# EAGLE design circuit (EAGLE 9.6.0)
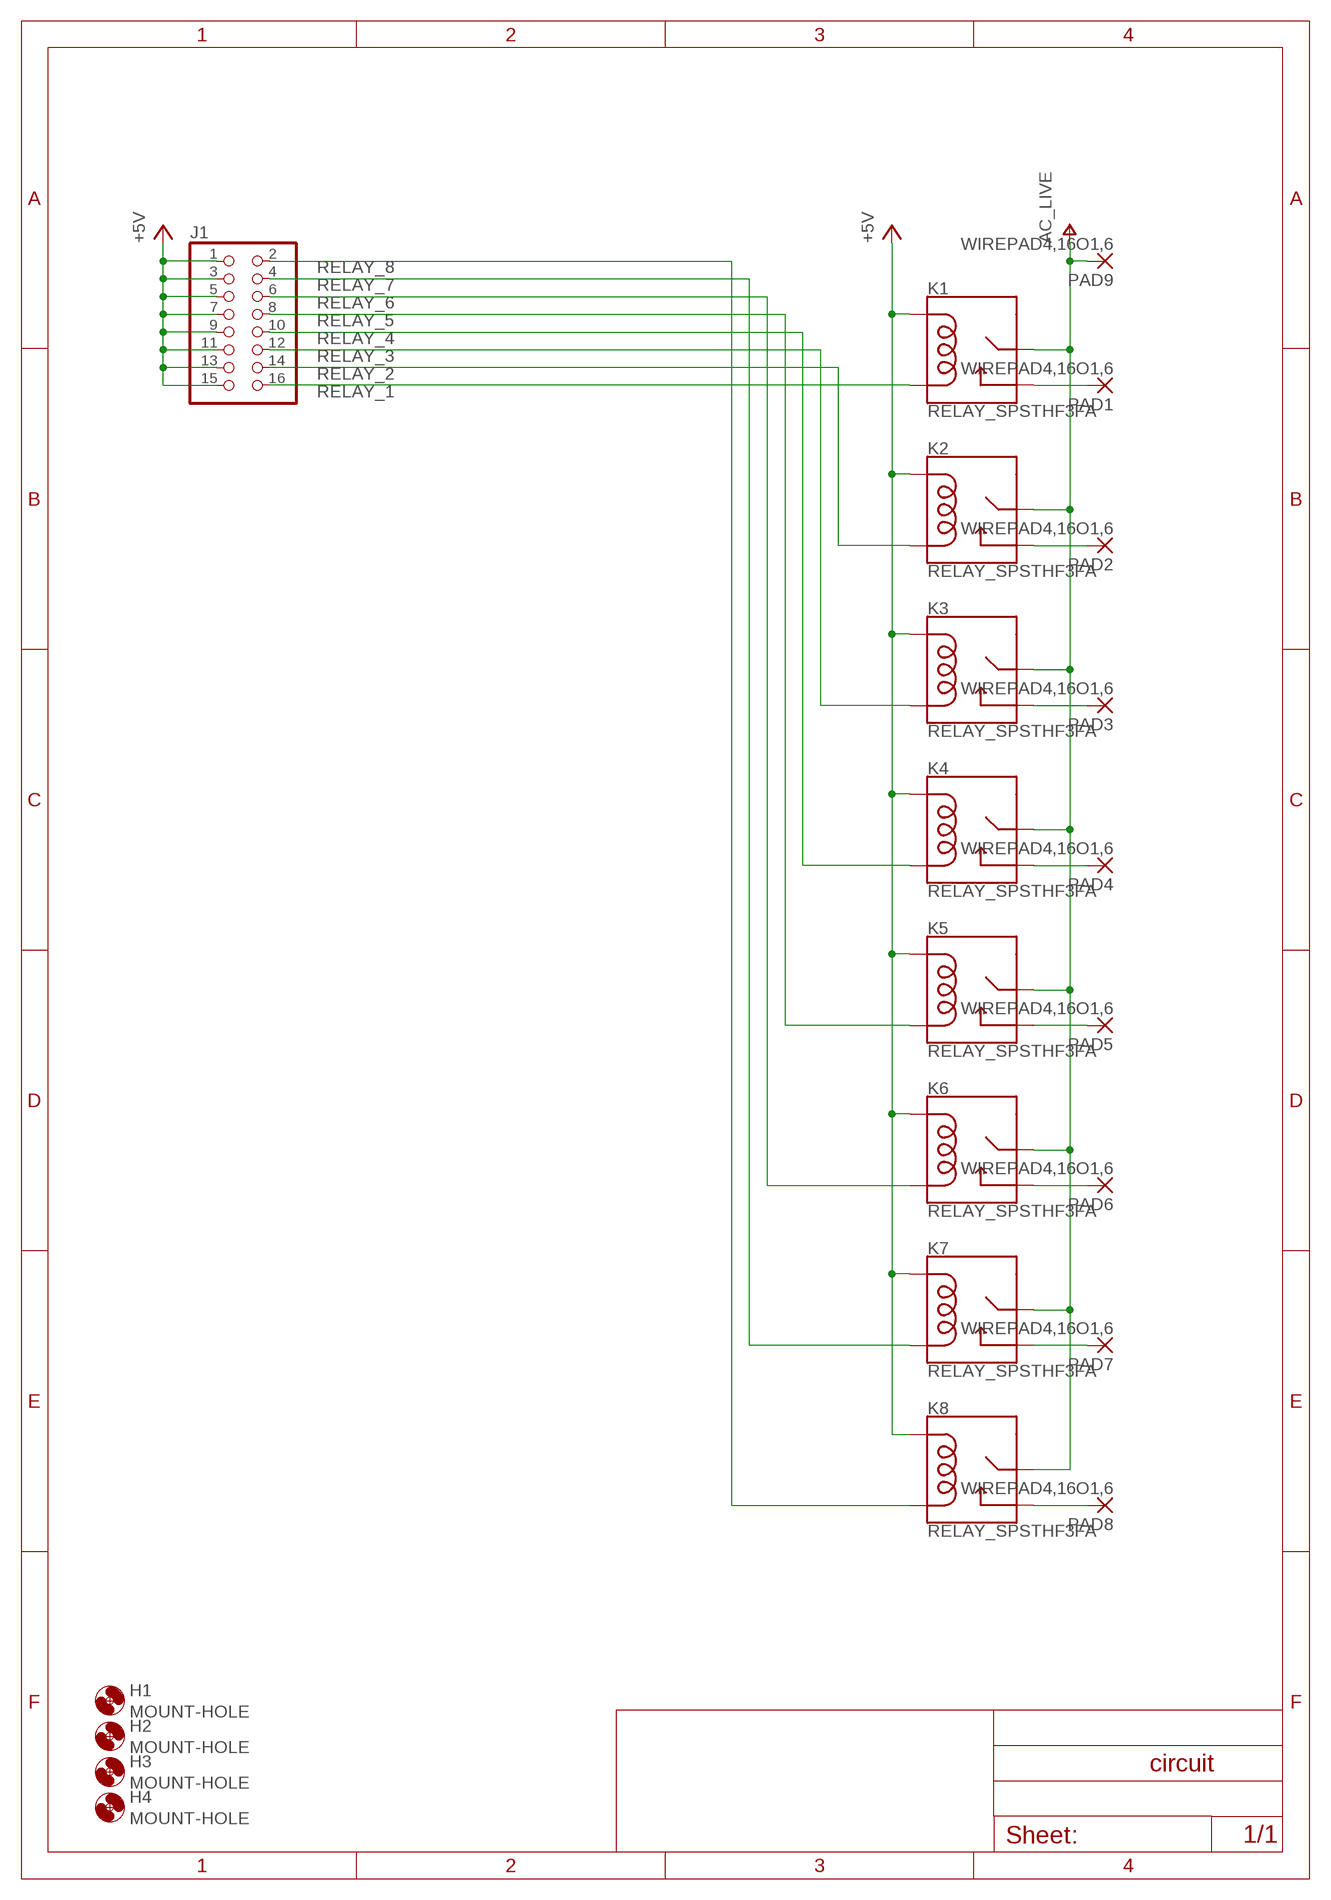
[diagram p0: schematic, sheet 1]

## Parts
H1  MOUNT-HOLE  [3,2]
H2  MOUNT-HOLE  [3,2]
H3  MOUNT-HOLE  [3,2]
H4  MOUNT-HOLE  [3,2]
J1  LED  PINHD-2X8  [2X08]
K1  RELAY_SPSTHF3FA  [RELAY_HF3FA]
K2  RELAY_SPSTHF3FA  [RELAY_HF3FA]
K3  RELAY_SPSTHF3FA  [RELAY_HF3FA]
K4  RELAY_SPSTHF3FA  [RELAY_HF3FA]
K5  RELAY_SPSTHF3FA  [RELAY_HF3FA]
K6  RELAY_SPSTHF3FA  [RELAY_HF3FA]
K7  RELAY_SPSTHF3FA  [RELAY_HF3FA]
K8  RELAY_SPSTHF3FA  [RELAY_HF3FA]
PAD1  WIREPAD4,16O1,6  [4,16O1,6]
PAD2  WIREPAD4,16O1,6  [4,16O1,6]
PAD3  WIREPAD4,16O1,6  [4,16O1,6]
PAD4  WIREPAD4,16O1,6  [4,16O1,6]
PAD5  WIREPAD4,16O1,6  [4,16O1,6]
PAD6  WIREPAD4,16O1,6  [4,16O1,6]
PAD7  WIREPAD4,16O1,6  [4,16O1,6]
PAD8  WIREPAD4,16O1,6  [4,16O1,6]
PAD9  WIREPAD4,16O1,6  [4,16O1,6]

## Nets
+5V: J1.1 J1.3 J1.5 J1.7 J1.9 J1.11 J1.13 J1.15 K1.P$1(COIL1) K2.P$1(COIL1) K3.P$1(COIL1) K4.P$1(COIL1) K5.P$1(COIL1) K6.P$1(COIL1) K7.P$1(COIL1) K8.P$1(COIL1)
N$17: K8.P$3(NO) PAD8.1(P)
N$18: K7.P$3(NO) PAD7.1(P)
N$19: K6.P$3(NO) PAD6.1(P)
N$20: K5.P$3(NO) PAD5.1(P)
N$21: K4.P$3(NO) PAD4.1(P)
N$22: K3.P$3(NO) PAD3.1(P)
N$23: K2.P$3(NO) PAD2.1(P)
N$24: K1.P$3(NO) PAD1.1(P)
RELAY_1: J1.16 K1.P$2(COIL2)
RELAY_2: J1.14 K2.P$2(COIL2)
RELAY_3: J1.12 K3.P$2(COIL2)
RELAY_4: J1.10 K4.P$2(COIL2)
RELAY_5: J1.8 K5.P$2(COIL2)
RELAY_6: J1.6 K6.P$2(COIL2)
RELAY_7: J1.4 K7.P$2(COIL2)
RELAY_8: J1.2 K8.P$2(COIL2)
V+: K1.P$4(MAIN) K2.P$4(MAIN) K3.P$4(MAIN) K4.P$4(MAIN) K5.P$4(MAIN) K6.P$4(MAIN) K7.P$4(MAIN) K8.P$4(MAIN) PAD9.1(P) ; supply symbol labelled AC_LIVE

## Library data of the parts
H1-H4 = THT:MOUNT-HOLE
J1 = THT:PINHD-2X8: PIN HEADER
K1-K8 = THT:RELAY_SPST
PAD1-PAD9 = THT:WIREPAD: Wire PAD connect wire on PCB

## Board
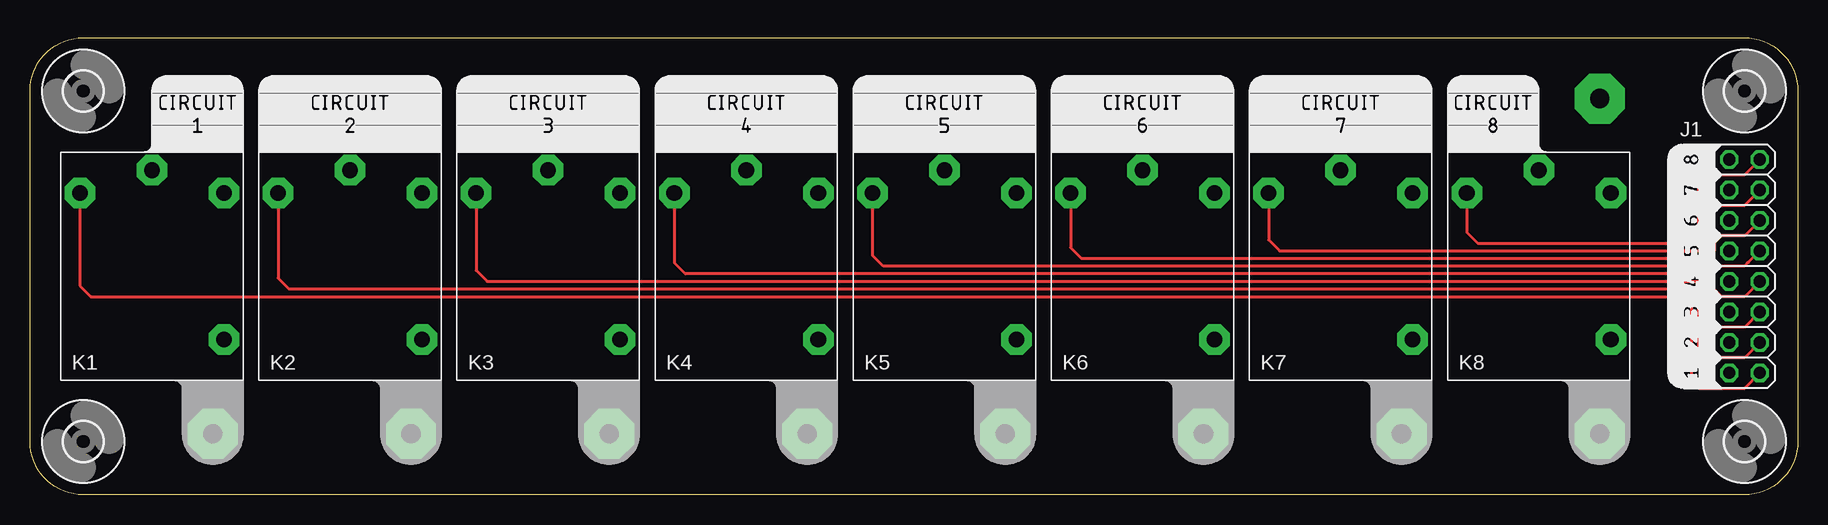
[diagram p1: board, top side]
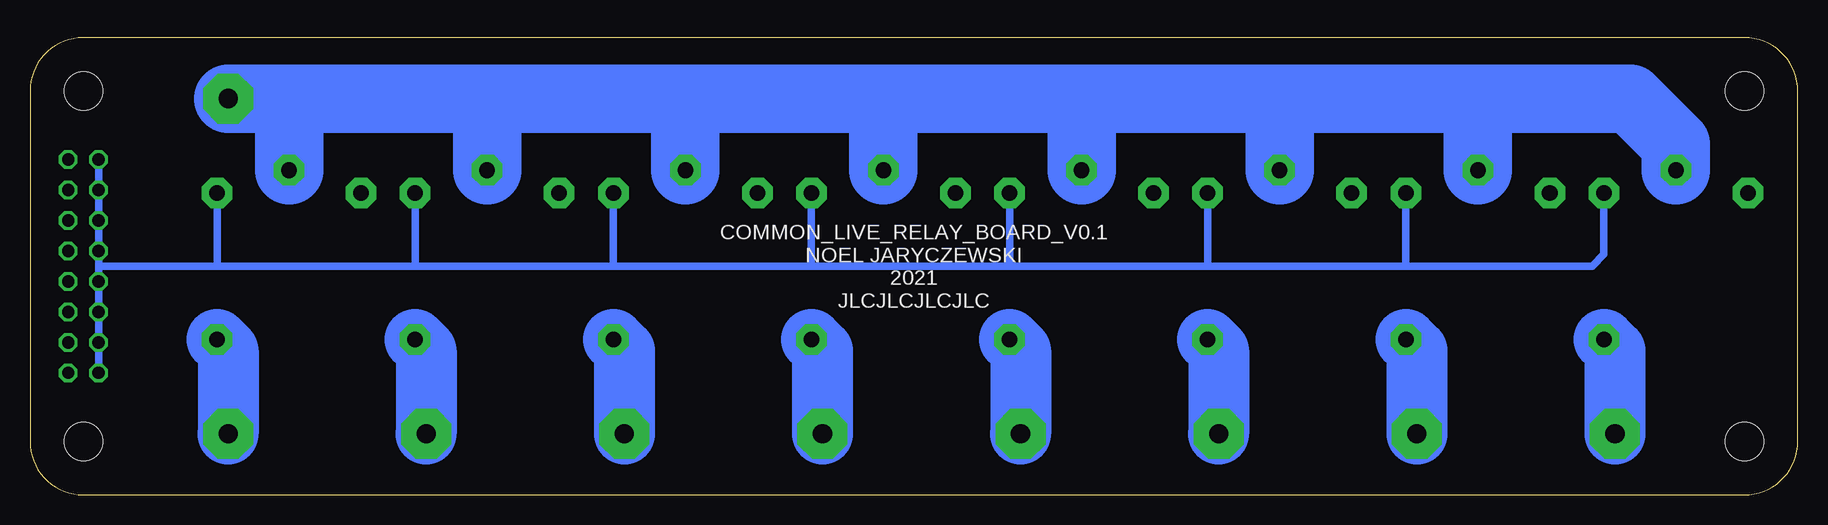
[diagram p2: board, bottom side, seen from below]

Size 147.32 x 38.1 mm. Coordinates in mm from the lower left corner, seen from the top.
Outline: 147.32,33.66 147.32,4.45 arc-90 142.88,0 4.45,0 arc-90 0,4.45 0,33.66 arc-90 4.45,38.1 142.88,38.1 arc-90 147.32,33.66
Copper layers (1*16): Top 0.035mm / dielectric 1.5mm / Bottom 0.035mm
Design rules "default *": minimum track width 8mil, minimum drill 0.4mm, track to track 8mil, track to pad 8mil, pad to pad 8mil, via to via 8mil, smd to smd 8mil, copper to edge 30mil, drill to drill 8mil, minimum pad ring 10mil, minimum via ring 8mil, stop-mask expansion 4mil, vias tented up to drill 0mil, thermal gap 10mil

### Footprints (pad centres in the part's own frame; a part is rotated, then mirrored left to right if it is on the bottom)
3,2 = hole 3.2: 0,0
2X08 = drill 1.016 octagon: 1 -8.89,-1.27; 2 -8.89,1.27; 3 -6.35,-1.27; 4 -6.35,1.27; 5 -3.81,-1.27; 6 -3.81,1.27; 7 -1.27,-1.27; 8 -1.27,1.27; 9 1.27,-1.27; 10 1.27,1.27; 11 3.81,-1.27; 12 3.81,1.27; 13 6.35,-1.27; 14 6.35,1.27; 15 8.89,-1.27; 16 8.89,1.27
RELAY_HF3FA = drill 1.3 pad 2.54 octagon: P$1 -6.1,6; P$2 -6.1,-6; P$3 6.1,6; P$4 -8,0
4,16O1,6 = drill 1.6 pad 4.166 octagon: 1 0,0

### Placement (x,y rotation side)
H1  142.88,4.45 0 top
H2  142.88,33.66 0 top
H3  4.45,33.66 0 top
H4  4.45,4.45 0 top
J1  142.88,19.05 270 top
K1  10.16,19.05 270 top
K2  26.67,19.05 270 top
K3  43.18,19.05 270 top
K4  59.69,19.05 270 top
K5  76.2,19.05 270 top
K6  92.71,19.05 270 top
K7  109.22,19.05 270 top
K8  125.73,19.05 270 top
PAD1  15.24,5.08 180 top
PAD2  31.75,5.08 180 top
PAD3  48.26,5.08 180 top
PAD4  64.77,5.08 180 top
PAD5  81.28,5.08 180 top
PAD6  97.79,5.08 180 top
PAD7  114.3,5.08 180 top
PAD8  130.81,5.08 180 top
PAD9  130.81,33.02 0 top

### Tracks (layer width: path | path; a pad name or v marks a point on that pad's centre or on a via)
+5V
  Bottom 0.61: J1.1 J1.3 J1.5 J1.7 141.6,19.05 | 141.6,19.05 J1.9 J1.11 J1.13 J1.15 | K1.P$1 16.16,20.04 17.14,19.05 32.67,19.05 | 32.67,19.05 49.18,19.05 | 49.18,19.05 65.69,19.05 | 65.69,19.05 82.2,19.05 | 82.2,19.05 98.71,19.05 | 98.71,19.05 115.22,19.05 | 115.22,19.05 131.73,19.05 | 131.73,19.05 141.6,19.05 | K8.P$1 131.73,19.4 131.73,19.05 | K7.P$1 115.22,19.4 115.22,19.05 | K6.P$1 98.71,19.4 98.71,19.05 | K5.P$1 82.2,19.4 82.2,19.05 | K4.P$1 65.69,19.4 65.69,19.05 | K3.P$1 49.18,19.4 49.18,19.05 | K2.P$1 32.67,19.4 32.67,19.05
N$17
  Bottom 5.08: K8.P$3 130.81,12.03 PAD8.1
N$18
  Bottom 5.08: K7.P$3 114.3,12.03 PAD7.1
N$19
  Bottom 5.08: K6.P$3 97.79,12.03 PAD6.1
N$20
  Bottom 5.08: K5.P$3 81.28,12.03 PAD5.1
N$21
  Bottom 5.08: K4.P$3 64.77,12.03 PAD4.1
N$22
  Bottom 5.08: K3.P$3 48.26,12.03 PAD3.1
N$23
  Bottom 5.08: K2.P$3 31.75,12.03 PAD2.1
N$24
  Bottom 5.08: K1.P$3 15.24,12.03 PAD1.1
RELAY_1
  Top 0.254: J1.16 142.88,8.89 139.06,8.89 138.43,9.53 138.43,15.88 137.79,16.51 5.08,16.51 4.16,17.43 K1.P$2
RELAY_2
  Top 0.254: K2.P$2 20.67,18.07 21.59,17.14 138.43,17.14 139.06,16.51 139.06,12.06 139.7,11.43 142.88,11.43 J1.14
RELAY_3
  Top 0.254: K3.P$2 37.18,18.7 38.1,17.78 139.06,17.78 139.7,17.14 139.7,14.61 140.34,13.97 142.88,13.97 J1.12
RELAY_4
  Top 0.254: K4.P$2 53.69,19.34 54.61,18.41 139.7,18.41 140.34,17.78 140.34,17.14 140.97,16.51 142.88,16.51 J1.10
RELAY_5
  Top 0.254: K5.P$2 70.2,19.97 71.12,19.05 142.88,19.05 143.19,19.37 J1.8
RELAY_6
  Top 0.254: K6.P$2 86.71,20.61 87.63,19.68 139.7,19.68 140.34,20.32 140.34,20.95 140.97,21.59 142.88,21.59 J1.6
RELAY_7
  Top 0.254: K7.P$2 103.22,21.24 104.14,20.32 139.06,20.32 139.7,20.95 139.7,23.5 140.34,24.13 142.88,24.13 J1.4
RELAY_8
  Top 0.254: K8.P$2 119.73,21.88 120.65,20.95 138.43,20.95 139.06,21.59 139.06,26.04 139.7,26.67 142.88,26.67 J1.2
V+
  Bottom 5.715: 125.73,33.02 109.22,33.02 | 109.22,33.02 92.71,33.02 | 92.71,33.02 76.2,33.02 | 76.2,33.02 59.69,33.02 | 59.69,33.02 43.18,33.02 | 43.18,33.02 26.67,33.02 | 26.67,33.02 13.97,33.02 10.16,29.21 K1.P$4 | K3.P$4 43.18,33.02 | K4.P$4 59.69,33.02 | K2.P$4 26.67,33.02 | K5.P$4 76.2,33.02 | K6.P$4 92.71,33.02 | K7.P$4 109.22,33.02 | K8.P$4 125.73,33.02 | PAD9.1 125.73,33.02

### Text on the board
bPlace: COMMON_LIVE_RELAY_BOARD_V0.1 / NOEL JARYCZEWSKI / 2021 / JLCJLCJLCJLC